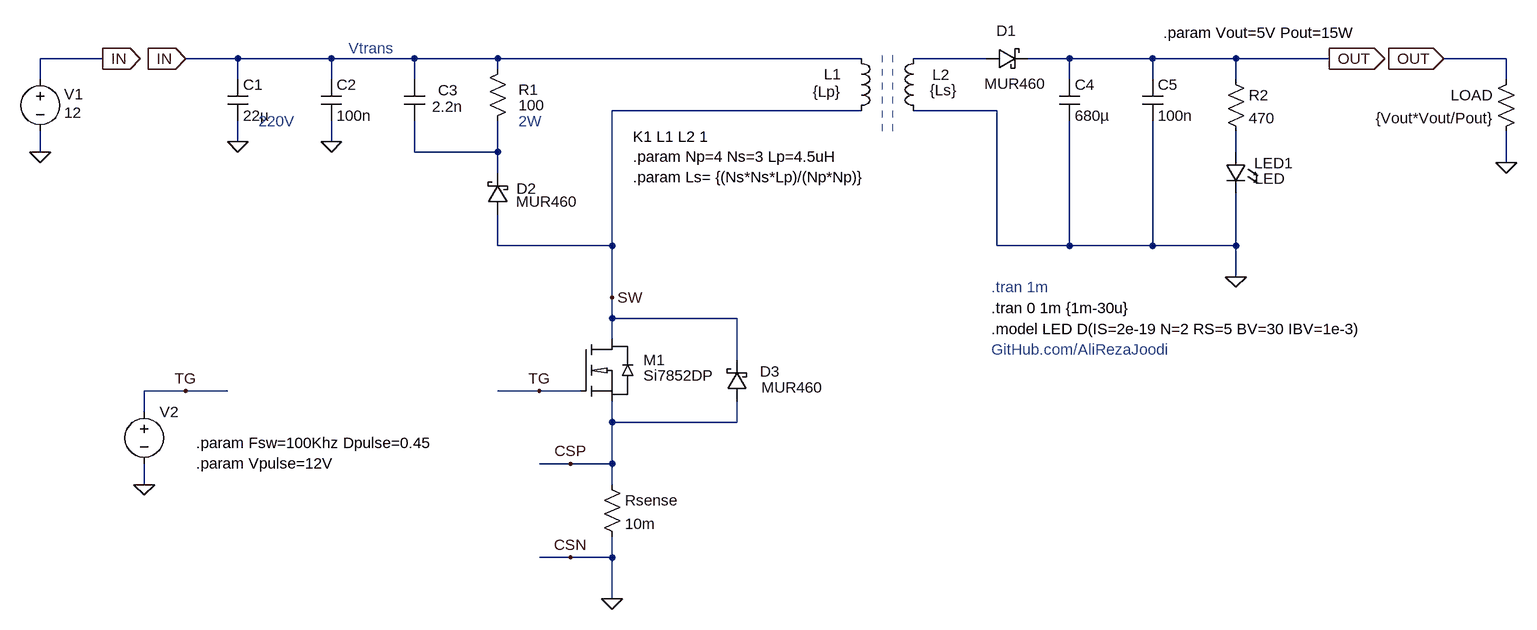
[diagram p0: schematic _PowerStage.asc]
_PowerStage.asc, the LTspice schematic file:
Version 4.1
SHEET 1 4452 1972
WIRE 1712 -2128 1616 -2128
WIRE 1920 -2128 1840 -2128
WIRE 2064 -2128 1920 -2128
WIRE 2192 -2128 2064 -2128
WIRE 2320 -2128 2192 -2128
WIRE 2880 -2128 2320 -2128
WIRE 3072 -2128 2960 -2128
WIRE 3200 -2128 3136 -2128
WIRE 3328 -2128 3200 -2128
WIRE 3456 -2128 3328 -2128
WIRE 3600 -2128 3456 -2128
WIRE 3872 -2128 3776 -2128
WIRE 2320 -2112 2320 -2128
WIRE 1616 -2096 1616 -2128
WIRE 1920 -2096 1920 -2128
WIRE 2064 -2096 2064 -2128
WIRE 2192 -2096 2192 -2128
WIRE 3200 -2096 3200 -2128
WIRE 3328 -2096 3328 -2128
WIRE 3456 -2096 3456 -2128
WIRE 3872 -2096 3872 -2128
WIRE 2880 -2048 2496 -2048
WIRE 3088 -2048 2960 -2048
WIRE 1920 -2000 1920 -2032
WIRE 2064 -2000 2064 -2032
WIRE 1616 -1984 1616 -2016
WIRE 2192 -1984 2192 -2032
WIRE 2320 -1984 2320 -2032
WIRE 2320 -1984 2192 -1984
WIRE 3456 -1984 3456 -2016
WIRE 3872 -1968 3872 -2016
WIRE 2320 -1952 2320 -1984
WIRE 2320 -1840 2320 -1888
WIRE 2496 -1840 2496 -2048
WIRE 2496 -1840 2320 -1840
WIRE 3088 -1840 3088 -2048
WIRE 3200 -1840 3200 -2032
WIRE 3200 -1840 3088 -1840
WIRE 3328 -1840 3328 -2032
WIRE 3328 -1840 3200 -1840
WIRE 3456 -1840 3456 -1920
WIRE 3456 -1840 3328 -1840
WIRE 3456 -1792 3456 -1840
WIRE 2496 -1760 2496 -1840
WIRE 2496 -1728 2496 -1760
WIRE 2688 -1728 2496 -1728
WIRE 2496 -1696 2496 -1728
WIRE 2688 -1664 2688 -1728
WIRE 1840 -1616 1776 -1616
WIRE 1904 -1616 1840 -1616
WIRE 2384 -1616 2320 -1616
WIRE 2448 -1616 2384 -1616
WIRE 1776 -1584 1776 -1616
WIRE 2496 -1568 2496 -1600
WIRE 2688 -1568 2688 -1600
WIRE 2688 -1568 2496 -1568
WIRE 2432 -1504 2384 -1504
WIRE 2496 -1504 2496 -1568
WIRE 2496 -1504 2432 -1504
WIRE 1776 -1472 1776 -1504
WIRE 2496 -1472 2496 -1504
WIRE 2432 -1360 2384 -1360
WIRE 2496 -1360 2496 -1392
WIRE 2496 -1360 2432 -1360
WIRE 2496 -1296 2496 -1360
FLAG 1616 -1984 0
FLAG 2496 -1296 0
FLAG 2064 -2000 0
FLAG 1712 -2128 IN
IOPIN 1712 -2128 Out
FLAG 1920 -2000 0
FLAG 3600 -2128 OUT
IOPIN 3600 -2128 Out
FLAG 3872 -1968 0
FLAG 2496 -1760 SW
FLAG 2384 -1616 TG
FLAG 3456 -1792 0
FLAG 1776 -1472 0
FLAG 1840 -1616 TG
FLAG 1840 -2128 IN
IOPIN 1840 -2128 In
FLAG 3776 -2128 OUT
IOPIN 3776 -2128 In
FLAG 2432 -1504 CSP
FLAG 2432 -1360 CSN
SYMBOL res 2480 -1488 R0
SYMATTR InstName Rsense
SYMATTR Value 10m
SYMBOL voltage 1616 -2112 R0
WINDOW 123 0 0 Left 0
WINDOW 39 24 105 Left 2
WINDOW 0 37 39 Left 2
WINDOW 3 37 67 Left 2
SYMATTR InstName V1
SYMATTR Value 12
SYMBOL ind 2864 -2144 R0
WINDOW 0 -15 40 Right 2
WINDOW 3 -15 67 Right 2
SYMATTR InstName L1
SYMATTR Value {Lp}
SYMATTR SpiceLine Rser=0.057
SYMATTR Type ind
SYMBOL cap 2176 -2032 M180
WINDOW 0 52 47 Left 2
WINDOW 3 43 22 Left 2
SYMATTR InstName C3
SYMATTR Value 2.2n
SYMATTR SpiceLine Rser=1m
SYMBOL res 2304 -2016 M180
WINDOW 0 48 64 Left 2
WINDOW 3 48 40 Left 2
SYMATTR InstName R1
SYMATTR Value 100
SYMATTR SpiceLine pwr=2
SYMBOL schottky 2336 -1888 R180
WINDOW 0 -44 40 Left 2
WINDOW 3 -12 20 Right 2
SYMATTR InstName D2
SYMATTR Value MUR460
SYMBOL cap 2048 -2096 R0
SYMATTR InstName C2
SYMATTR Value 100n
SYMBOL schottky 2704 -1600 R180
WINDOW 0 -50 46 Left 2
WINDOW 3 -117 22 Left 2
SYMATTR InstName D3
SYMATTR Value MUR460
SYMBOL cap 1904 -2096 R0
SYMATTR InstName C1
SYMATTR Value 22µ
SYMBOL ind 2976 -2032 R180
WINDOW 0 -40 71 Left 2
WINDOW 3 -9 47 Right 2
SYMATTR InstName L2
SYMATTR Value {Ls}
SYMATTR SpiceLine Rser=0.011
SYMATTR Type ind
SYMBOL schottky 3072 -2112 R270
WINDOW 0 43 31 VTop 2
WINDOW 3 -7 45 VBottom 2
SYMATTR InstName D1
SYMATTR Value MUR460
SYMBOL cap 3184 -2096 R0
SYMATTR InstName C4
SYMATTR Value 680µ
SYMBOL cap 3312 -2096 R0
SYMATTR InstName C5
SYMATTR Value 100n
SYMBOL res 3440 -2112 R0
SYMATTR InstName R2
SYMATTR Value 470
SYMBOL LED 3472 -1984 M0
WINDOW 0 -72 17 Left 2
WINDOW 3 -60 41 Left 2
SYMATTR InstName LED1
SYMATTR Value LED
SYMBOL res 3888 -2112 M0
SYMATTR InstName LOAD
SYMATTR Value {Vout*Vout/Pout}
SYMBOL voltage 1776 -1600 R0
WINDOW 123 24 138 Left 2
WINDOW 39 24 117 Left 2
WINDOW 3 41 64 Invisible 2
SYMATTR Value PULSE(0 {Vpulse} 0 {0.01/Fsw} {0.01/Fsw} {Dpulse/Fsw} {1/Fsw})
SYMATTR InstName V2
SYMBOL MyLib\\Transistor_MOSFET_N\\MOSFET_N 2448 -1696 R0
SYMATTR InstName M1
SYMATTR Value Si7852DP
TEXT 3080 -1712 Left 2 !.model LED D(IS=2e-19 N=2 RS=5 BV=30 IBV=1e-3)
TEXT 3080 -1680 Left 2 ;GitHub.com/AliRezaJoodi
TEXT 2352 -2032 Left 2 ;2W
TEXT 1952 -2032 Left 2 ;220V
TEXT 3344 -2168 Left 2 !.param Vout=5V Pout=15W
TEXT 2528 -2008 Left 2 !K1 L1 L2 1\n.param Np=4 Ns=3 Lp=4.5uH\n.param Ls= {(Ns*Ns*Lp)/(Np*Np)}
TEXT 3080 -1744 Left 2 !.tran 0 1m {1m-30u}
TEXT 3080 -1776 Left 2 ;.tran 1m
TEXT 2160 -2144 Right 2 ;Vtrans
TEXT 1856 -1536 Left 2 !.param Fsw=100Khz Dpulse=0.45\n.param Vpulse=12V
LINE Normal 2928 -2016 2928 -2144 2
LINE Normal 2912 -2016 2912 -2144 2

The netlist it stands for:
* _PowerStage.asc
Rsense CSP 0 10m
V1 IN 0 12
L1 IN SW {Lp} Rser=0.057
C3 N002 IN 2.2n Rser=1m
R1 N002 IN 100 pwr=2
D2 SW N002 MUR460
C2 IN 0 100n
D3 CSP SW MUR460
C1 IN 0 22µ
L2 0 N001 {Ls} Rser=0.011
D1 N001 OUT MUR460
C4 OUT 0 680µ
C5 OUT 0 100n
R2 OUT N003 470
D§LED1 N003 0 LED
R§LOAD OUT 0 {Vout*Vout/Pout}
V2 TG 0 PULSE(0 {Vpulse} 0 {0.01/Fsw} {0.01/Fsw} {Dpulse/Fsw} {1/Fsw})
M1 SW TG CSP CSP Si7852DP
.model D D
.lib standard.dio
.model NMOS NMOS
.model PMOS PMOS
.lib standard.mos
.model LED D(IS=2e-19 N=2 RS=5 BV=30 IBV=1e-3)
* GitHub.com/AliRezaJoodi
* 2W
* 220V
.param Vout=5V Pout=15W
K1 L1 L2 1
.param Np=4 Ns=3 Lp=4.5uH
.param Ls= {(Ns*Ns*Lp)/(Np*Np)}
.tran 0 1m {1m-30u}
* .tran 1m
* Vtrans
.param Fsw=100Khz Dpulse=0.45
.param Vpulse=12V
.backanno
.end